# Altium schematic sheet DIY_DAP_PCB_MicroSD.SchDoc: DIY_DAP_PCB_MicroSD
size A4; Revision: A; SheetNumber: 3; SheetTotal: 4
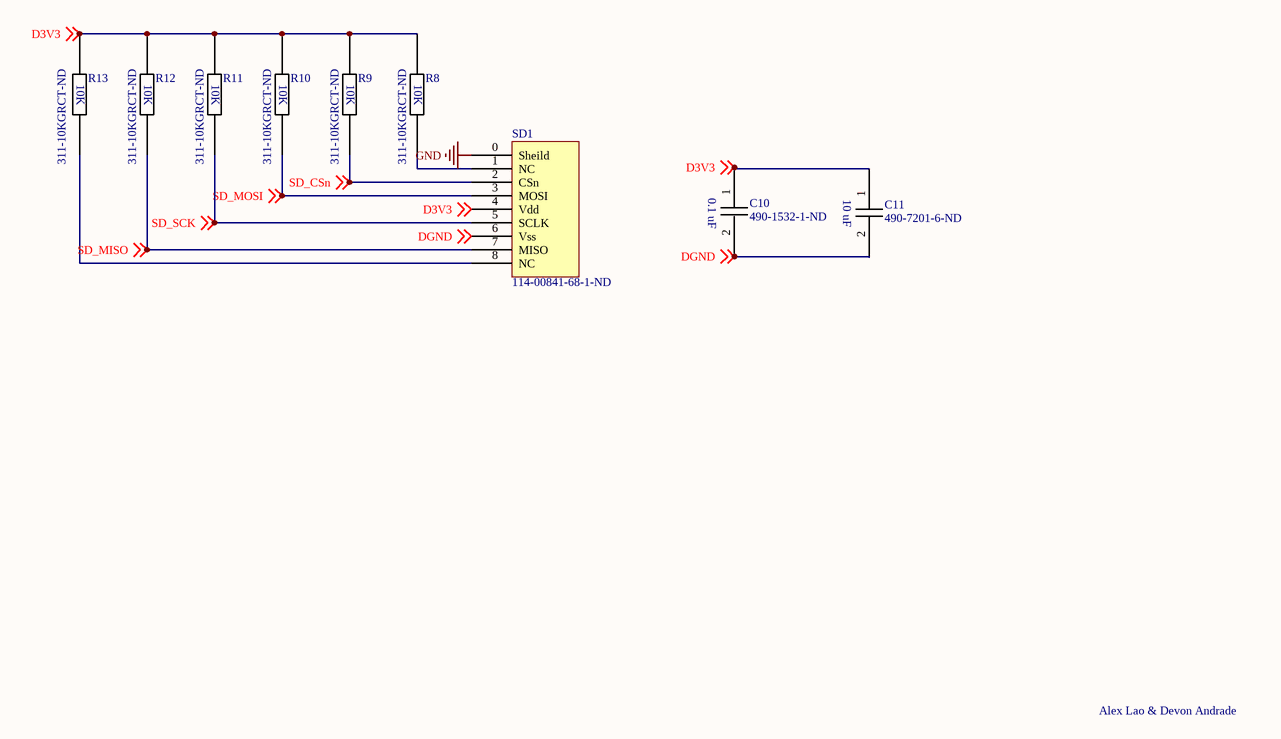
[diagram p0: DIY_DAP_PCB_MicroSD.SchDoc]

## Parts
C10  490-1532-1-ND  [0603]
C11  490-7201-6-ND  [0603]
R8  311-10KGRCT-ND  [0603]
R9  311-10KGRCT-ND  [0603]
R10  311-10KGRCT-ND  [0603]
R11  311-10KGRCT-ND  [0603]
R12  311-10KGRCT-ND  [0603]
R13  311-10KGRCT-ND  [0603]
SD1  114-00841-68-1-ND  [114-00841-68-1-ND]

## Nets
GND: SD1.0(Sheild)
D3V3: C10.1 C11.1 R8.1 R9.1 R10.1 R11.1 R12.1 R13.1 SD1.4(Vdd) ; off-sheet D3V3
DGND: C10.2 C11.2 SD1.6(Vss) ; off-sheet DGND
SD_CSn: R9.2 SD1.2(CSn) ; off-sheet SD_CSn
SD_MISO: R12.2 SD1.7(MISO) ; off-sheet SD_MISO
SD_MOSI: R10.2 SD1.3(MOSI) ; off-sheet SD_MOSI
SD_SCK: R11.2 SD1.5(SCLK) ; off-sheet SD_SCK
NetR8_2: R8.2 SD1.1(NC)
NetR13_2: R13.2 SD1.8(NC)

## Notes on the sheet
- Alex Lao & Devon Andrade
- (in symbol 311-10KGRCT-ND) 10K
- (in symbol 490-1532-1-ND) 0.1 uF
- (in symbol 490-7201-6-ND) 10 uF

## Library data of the parts
C10 = 490-1532-1-ND: 0603 0.1 uF - 16V - Ceramic Capacitor; Supplier 1: Digi-Key
C11 = 490-7201-6-ND: 0603 10 uF - 16V - Ceramic Capacitor; Supplier 1: Digi-Key
R8-R13 = 311-10KGRCT-ND: 10k Ohm Resistor; Supplier 1: Digi-Key
SD1 = 114-00841-68-1-ND: MicroSD Card Slot; Supplier 1: Digi-Key